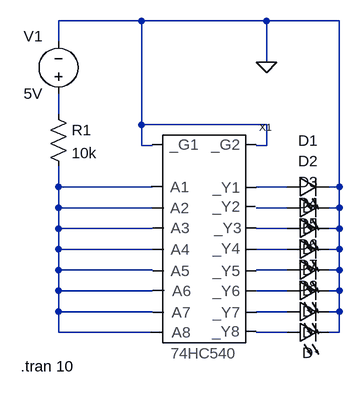
[diagram p0: schematic 74HC540_test.asc]
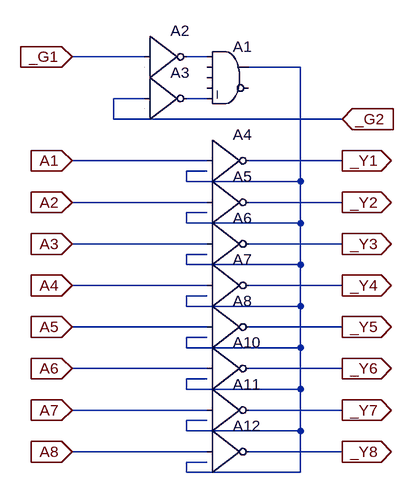
[diagram p1: sub-circuit 74hc540.asc]
74HC540_test.asc, the LTspice schematic file:
Version 4
SHEET 1 880 680
WIRE 64 -96 -64 -96
WIRE 256 -96 64 -96
WIRE 368 -96 256 -96
WIRE -64 -64 -64 -96
WIRE 256 -32 256 -96
WIRE -64 48 -64 16
WIRE 64 64 64 -96
WIRE 256 64 64 64
WIRE 64 96 64 64
WIRE 80 96 64 96
WIRE 256 96 256 64
WIRE 256 96 240 96
WIRE -64 160 -64 128
WIRE 80 160 -64 160
WIRE 288 160 240 160
WIRE 368 160 368 -96
WIRE 368 160 352 160
WIRE -64 192 -64 160
WIRE 80 192 -64 192
WIRE 288 192 240 192
WIRE 368 192 368 160
WIRE 368 192 352 192
WIRE -64 224 -64 192
WIRE 80 224 -64 224
WIRE 288 224 240 224
WIRE 368 224 368 192
WIRE 368 224 352 224
WIRE -64 256 -64 224
WIRE 80 256 -64 256
WIRE 288 256 240 256
WIRE 368 256 368 224
WIRE 368 256 352 256
WIRE -64 288 -64 256
WIRE 80 288 -64 288
WIRE 288 288 240 288
WIRE 368 288 368 256
WIRE 368 288 352 288
WIRE -64 320 -64 288
WIRE 80 320 -64 320
WIRE 288 320 240 320
WIRE 368 320 368 288
WIRE 368 320 352 320
WIRE -64 352 -64 320
WIRE 80 352 -64 352
WIRE 288 352 240 352
WIRE 368 352 368 320
WIRE 368 352 352 352
WIRE -64 384 -64 352
WIRE 80 384 -64 384
WIRE 288 384 240 384
WIRE 368 384 368 352
WIRE 368 384 352 384
FLAG 256 -32 0
SYMBOL res -80 32 R0
SYMATTR InstName R1
SYMATTR Value 10k
SYMBOL voltage -64 32 R180
WINDOW 0 24 104 Left 0
WINDOW 3 24 16 Left 0
WINDOW 123 0 0 Left 0
WINDOW 39 0 0 Left 0
SYMATTR InstName V1
SYMATTR Value 5V
SYMBOL 74HC540 160 240 R0
SYMATTR InstName X1
SYMBOL LED 288 176 R270
WINDOW 0 72 32 VTop 0
WINDOW 3 0 32 VBottom 0
SYMATTR InstName D1
SYMBOL LED 288 208 R270
WINDOW 0 72 32 VTop 0
WINDOW 3 0 32 VBottom 0
SYMATTR InstName D2
SYMBOL LED 288 240 R270
WINDOW 0 72 32 VTop 0
WINDOW 3 0 32 VBottom 0
SYMATTR InstName D3
SYMBOL LED 288 272 R270
WINDOW 0 72 32 VTop 0
WINDOW 3 0 32 VBottom 0
SYMATTR InstName D4
SYMBOL LED 288 304 R270
WINDOW 0 72 32 VTop 0
WINDOW 3 0 32 VBottom 0
SYMATTR InstName D5
SYMBOL LED 288 336 R270
WINDOW 0 72 32 VTop 0
WINDOW 3 0 32 VBottom 0
SYMATTR InstName D6
SYMBOL LED 288 368 R270
WINDOW 0 72 32 VTop 0
WINDOW 3 0 32 VBottom 0
SYMATTR InstName D7
SYMBOL LED 288 400 R270
WINDOW 0 72 32 VTop 0
WINDOW 3 0 32 VBottom 0
SYMATTR InstName D8
TEXT -122 436 Left 0 !.tran 10

74hc540.asc, the sub-circuit schematic file:
Version 4
SHEET 1 880 792
WIRE -80 112 -192 112
WIRE 16 112 -16 112
WIRE 160 128 80 128
WIRE -80 176 -128 176
WIRE 16 176 -16 176
WIRE -128 208 -128 176
WIRE 224 208 -128 208
WIRE 16 272 -192 272
WIRE 224 272 80 272
WIRE 16 288 -16 288
WIRE -16 304 -16 288
WIRE 160 304 160 128
WIRE 160 304 -16 304
WIRE 16 336 -192 336
WIRE 224 336 80 336
WIRE 16 352 -16 352
WIRE -16 368 -16 352
WIRE 160 368 160 304
WIRE 160 368 -16 368
WIRE 16 400 -192 400
WIRE 224 400 80 400
WIRE 16 416 -16 416
WIRE -16 432 -16 416
WIRE 160 432 160 368
WIRE 160 432 -16 432
WIRE 16 464 -192 464
WIRE 224 464 80 464
WIRE 16 480 -16 480
WIRE -16 496 -16 480
WIRE 160 496 160 432
WIRE 160 496 -16 496
WIRE 16 528 -192 528
WIRE 224 528 80 528
WIRE 16 544 -16 544
WIRE -16 560 -16 544
WIRE 160 560 160 496
WIRE 160 560 -16 560
WIRE 16 592 -192 592
WIRE 224 592 80 592
WIRE 16 608 -16 608
WIRE -16 624 -16 608
WIRE 160 624 160 560
WIRE 160 624 -16 624
WIRE 16 656 -192 656
WIRE 224 656 80 656
WIRE 16 672 -16 672
WIRE -16 688 -16 672
WIRE 160 688 160 624
WIRE 160 688 -16 688
WIRE 16 720 -192 720
WIRE 224 720 80 720
WIRE 16 736 -16 736
WIRE -16 752 -16 736
WIRE 160 752 160 688
WIRE 160 752 -16 752
FLAG -192 112 _G1
IOPIN -192 112 In
FLAG -192 272 A1
IOPIN -192 272 In
FLAG -192 336 A2
IOPIN -192 336 In
FLAG -192 400 A3
IOPIN -192 400 In
FLAG -192 464 A4
IOPIN -192 464 In
FLAG -192 528 A5
IOPIN -192 528 In
FLAG -192 592 A6
IOPIN -192 592 In
FLAG -192 656 A7
IOPIN -192 656 In
FLAG -192 720 A8
IOPIN -192 720 In
FLAG 224 272 _Y1
IOPIN 224 272 Out
FLAG 224 336 _Y2
IOPIN 224 336 Out
FLAG 224 400 _Y3
IOPIN 224 400 Out
FLAG 224 464 _Y4
IOPIN 224 464 Out
FLAG 224 528 _Y5
IOPIN 224 528 Out
FLAG 224 592 _Y6
IOPIN 224 592 Out
FLAG 224 656 _Y7
IOPIN 224 656 Out
FLAG 224 720 _Y8
IOPIN 224 720 Out
FLAG 224 208 _G2
IOPIN 224 208 In
SYMBOL Digital\\and 48 80 R0
SYMATTR InstName A1
SYMBOL Digital\\inv -80 48 R0
SYMATTR InstName A2
SYMBOL Digital\\inv -80 112 R0
SYMATTR InstName A3
SYMBOL Digital\\inv 16 208 R0
SYMATTR InstName A4
SYMBOL Digital\\inv 16 272 R0
SYMATTR InstName A5
SYMBOL Digital\\inv 16 336 R0
SYMATTR InstName A6
SYMBOL Digital\\inv 16 400 R0
SYMATTR InstName A7
SYMBOL Digital\\inv 16 464 R0
SYMATTR InstName A8
SYMBOL Digital\\inv 16 528 R0
SYMATTR InstName A10
SYMBOL Digital\\inv 16 592 R0
SYMATTR InstName A11
SYMBOL Digital\\inv 16 656 R0
SYMATTR InstName A12

The netlist it stands for:
* 74HC540_test.asc
R1 N001 N002 10k
V1 N001 0 5V
XX1 0 N002 N002 N002 N002 N002 N002 N002 N002 0 N003 N004 N005 N006 N007 N008 N009 N010 74hc540
D1 N003 0 D
D2 N004 0 D
D3 N005 0 D
D4 N006 0 D
D5 N007 0 D
D6 N008 0 D
D7 N009 0 D
D8 N010 0 D

* block symbol definitions
.subckt 74hc540 _G1 A1 A2 A3 A4 A5 A7 A6 A8 _G2 _Y1 _Y2 _Y3 _Y4 _Y5 _Y6 _Y7 _Y8
A1 N001 0 0 0 N003 0 N002 0 AND
A2 _G1 0 0 0 0 N001 0 0 BUF
A3 _G2 0 0 0 0 N003 0 0 BUF
A4 A1 N002 N002 N002 N002 _Y1 N002 N002 BUF
A5 A2 N002 N002 N002 N002 _Y2 N002 N002 BUF
A6 A3 N002 N002 N002 N002 _Y3 N002 N002 BUF
A7 A4 N002 N002 N002 N002 _Y4 N002 N002 BUF
A8 A5 N002 N002 N002 N002 _Y5 N002 N002 BUF
A10 A6 N002 N002 N002 N002 _Y6 N002 N002 BUF
A11 A7 N002 N002 N002 N002 _Y7 N002 N002 BUF
A12 A8 N002 N002 N002 N002 _Y8 N002 N002 BUF
.ends 74hc540

.model D D
.lib standard.dio
.tran 10
.backanno
.end